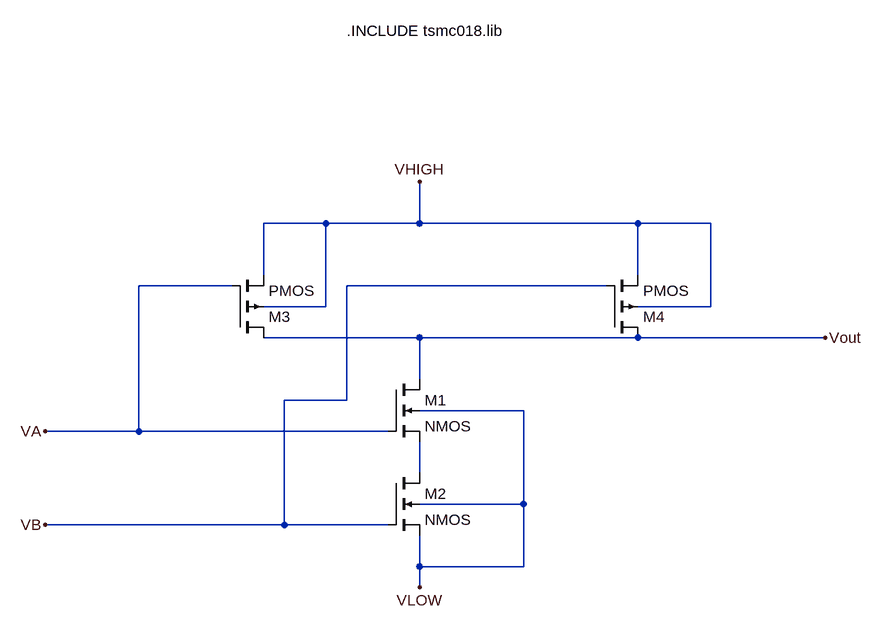
[diagram p0: schematic Exp-5.asc]
Exp-5.asc, the LTspice schematic file:
Version 4
SHEET 1 880 740
WIRE -16 64 -112 64
WIRE 128 64 128 0
WIRE 128 64 -16 64
WIRE 464 64 128 64
WIRE 576 64 464 64
WIRE -112 144 -112 64
WIRE 464 144 464 64
WIRE -160 160 -304 160
WIRE 416 160 16 160
WIRE -16 192 -16 64
WIRE -16 192 -112 192
WIRE 576 192 576 64
WIRE 576 192 464 192
WIRE 128 240 -112 240
WIRE 464 240 128 240
WIRE 752 240 464 240
WIRE 128 304 128 240
WIRE 16 336 16 160
WIRE 16 336 -80 336
WIRE 288 352 128 352
WIRE -304 384 -304 160
WIRE -304 384 -448 384
WIRE 80 384 -304 384
WIRE 128 448 128 400
WIRE 288 496 288 352
WIRE 288 496 128 496
WIRE -80 528 -80 336
WIRE -80 528 -448 528
WIRE 80 528 -80 528
WIRE 128 592 128 544
WIRE 288 592 288 496
WIRE 288 592 128 592
WIRE 128 624 128 592
FLAG 128 0 VHIGH
FLAG 128 624 VLOW
FLAG -448 384 VA
FLAG -448 528 VB
FLAG 752 240 Vout
SYMBOL nmos4 80 304 R0
SYMATTR InstName M1
SYMATTR Value2 l=180n w=400n
SYMBOL nmos4 80 448 R0
SYMATTR InstName M2
SYMATTR Value2 l=180n w=400n
SYMBOL pmos4 -160 240 M180
SYMATTR InstName M3
SYMATTR Value2 l=180n w=800n
SYMBOL pmos4 416 240 M180
SYMATTR InstName M4
SYMATTR Value2 l=180n w=800n
TEXT 16 -232 Left 2 !.INCLUDE tsmc018.lib

The netlist it stands for:
* Exp-5.asc
M1 Vout VA N001 VLOW NMOS l=180n w=400n
M2 N001 VB VLOW VLOW NMOS l=180n w=400n
M3 Vout VA VHIGH VHIGH PMOS l=180n w=800n
M4 Vout VB VHIGH VHIGH PMOS l=180n w=800n
.model NMOS NMOS
.model PMOS PMOS
.lib standard.mos
.INCLUDE tsmc018.lib
.backanno
.end